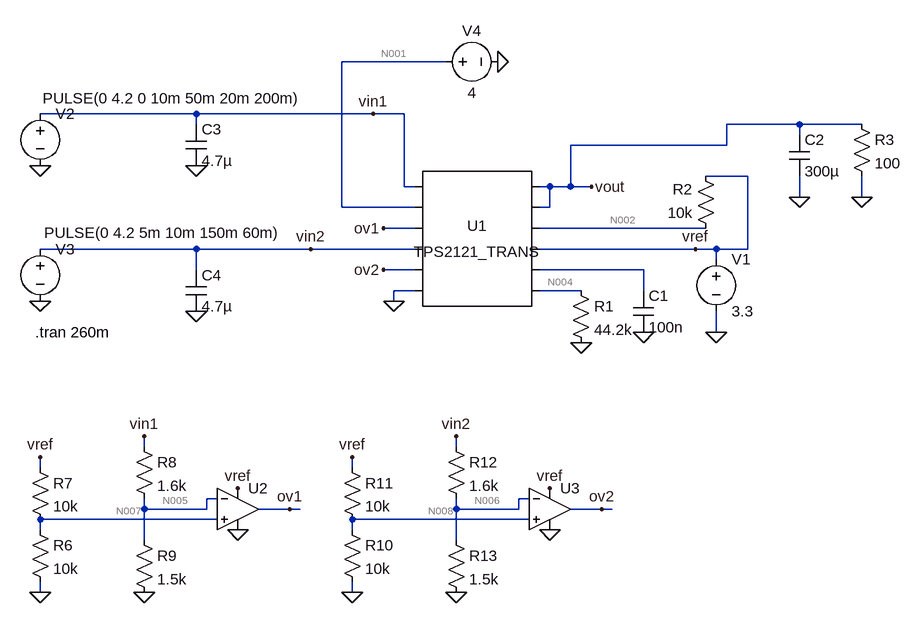
[diagram p0: schematic load-switch.asc]
* load-switch.asc
* U1: TPS2121_TRANS (symbol AutoGenerated\TPS2121_TRANS not available, pins judged from their places): pin1=vin1 pin2=N001 pin3=ov1 pin4=vin2 pin5=ov2 pin6=0 pin7=vout pin8=vout pin9=N002 pin10=vref pin11=N003 pin12=N004
R1 N004 0 44.2k
C1 N003 0 100n
R2 N002 vref 10k
C2 vout 0 300µ
R3 vout 0 100
V1 vref 0 3.3
V2 vin1 0 PULSE(0 4.2 0 10m 50m 20m 200m)
V3 vin2 0 PULSE(0 4.2 5m 10m 150m 60m)
C3 vin1 0 4.7µ
C4 vin2 0 4.7µ
XU2 N007 N005 vref 0 ov1 level2 Avol=1Meg GBW=10Meg Slew=10Meg Ilimit=25m Rail=0 Vos=0 En=0 Enk=0 In=0 Ink=0 Rin=500Meg  ; pins In+ In- V+ V- OUT
R6 N007 0 10k
R7 vref N007 10k
R8 vin1 N005 1.6k
R9 N005 0 1.5k
XU3 N008 N006 vref 0 ov2 level2 Avol=1Meg GBW=10Meg Slew=10Meg Ilimit=25m Rail=0 Vos=0 En=0 Enk=0 In=0 Ink=0 Rin=500Meg  ; pins In+ In- V+ V- OUT
R10 N008 0 10k
R11 vref N008 10k
R12 vin2 N006 1.6k
R13 N006 0 1.5k
V4 N001 0 4
.tran 260m
.lib UniversalOpAmp2.lib
.backanno
.end

* Results of the author's LTspice run, read from the files saved beside the schematic
* Operating Point, zero values left out:
*   V(vout) = 3.775 mV
*   V(n001) = 4 V
*   V(ov1) = 3.3 V
*   V(ov2) = 3.3 V
*   V(vref) = 3.3 V
*   V(n002) = 16.5 µV
*   V(n004) = 88.4 mV
*   V(n005) = 2.555 µV
*   V(n007) = 1.65 V
*   V(n006) = 2.555 µV
*   V(n008) = 1.65 V
*   I(R13) = 1.703 nA
*   I(R12) = -1.597 nA
*   I(R11) = 165 µA
*   I(R10) = 165 µA
*   I(R9) = 1.703 nA
*   I(R8) = -1.597 nA
*   I(R7) = 165 µA
*   I(R6) = 165 µA
*   I(R3) = 37.75 µA
*   I(R2) = -330 µA
*   I(R1) = 2 µA
*   I(V3) = 1.597 nA
*   I(V2) = 1.597 nA
*   I(V1) = -660.6 µA
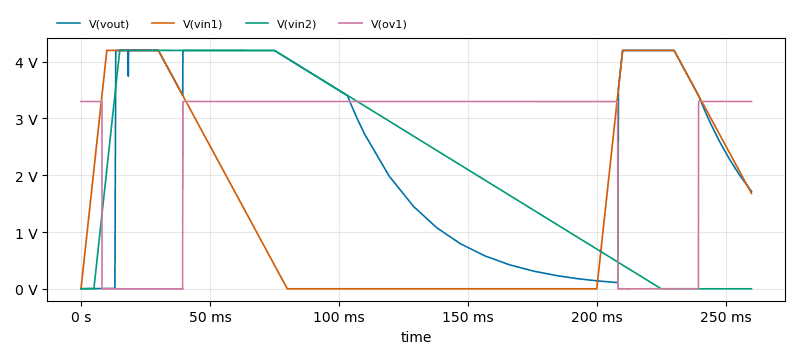
[diagram p1: Transient Analysis of load-switch.asc, plotted from the saved traces]
* Transient Analysis, 1 run:
*   V(vout): min 3.775 mV, max 4.198 V, average 2.462 V, rms 2.968 V, last 1.719 V
*   V(vin1): min 0 V, max 4.2 V, average 1.551 V, rms 2.33 V, last 1.68 V
*   V(vin2): min 0 V, max 4.2 V, average 2.262 V, rms 2.774 V, last 0 V
*   V(ov1): min 3.542 µV, max 3.3 V, average 2.505 V, rms 2.875 V, last 3.3 V